# EAGLE schematic single_sensor (EAGLE 8.7.0)
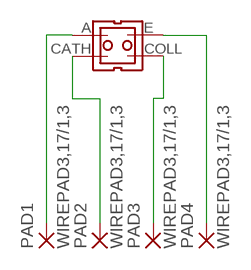
[diagram p0: schematic, sheet 1]

## Parts
PAD1  WIREPAD3,17/1,3  [3,17/1,3]
PAD2  WIREPAD3,17/1,3  [3,17/1,3]
PAD3  WIREPAD3,17/1,3  [3,17/1,3]
PAD4  WIREPAD3,17/1,3  [3,17/1,3]
U$1  CNY70  [CNY70]

## Nets
N$1: PAD1.1(P) U$1.A(5V(DIG))
N$2: PAD2.1(P) U$1.CATH(GND(DIG))
N$3: PAD4.1(P) U$1.E(GND(PWR))
N$4: PAD3.1(P) U$1.COLL(5V(PWR))

## Library data of the parts
PAD1-PAD4 = wirepad:WIREPAD: Wire PAD connect wire on PCB
U$1 = ferraris_sensor_project:CNY70